# Altium schematic sheet Sheet2.SchDoc
size A4
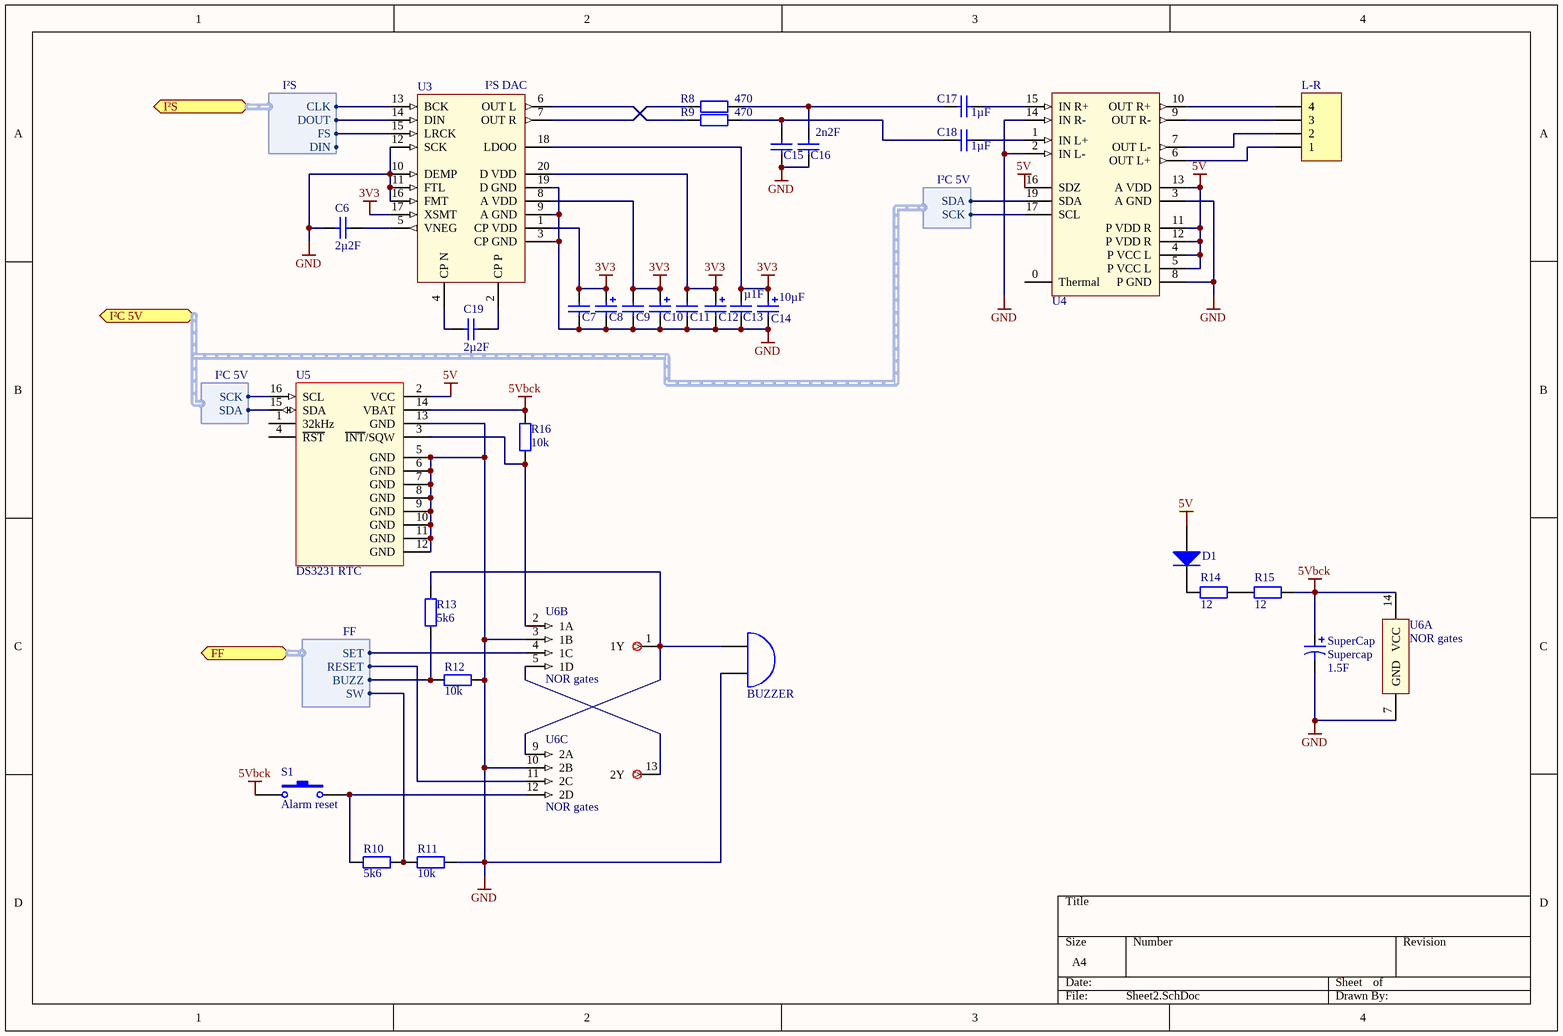
[diagram p0: Sheet2.SchDoc]

## Parts
BUZZER  (no value)  [HDR1X2]
C6  value 2µ2F  [C0805]
C7  value µ1F  [C0805]
C8  (no value)  [SMD cap 6x5]
C9  (no value)  [C0805]
C10  (no value)  [SMD cap 6x5]
C11  (no value)  [C0805]
C12  (no value)  [SMD cap 6x5]
C13  (no value)  [C0805]
C14  value 10µF  [SMD cap 6x5]
C15  (no value)  [C0805]
C16  value 2n2F  [C0805]
C17  value 1µF  [C0805]
C18  value 1µF  [C0805]
C19  value 2µ2F  [C0805]
D1  (no value)  [AXIAL-0.3]
L-R  Header 4  [HDR1X4]  (value not drawn)
R8  value 470  [C1206]
R9  value 470  [C1206]
R10  value 5k6  [C1206]
R11  value 10k  [C1206]
R12  value 10k  [C1206]
R13  value 5k6  [C1206]
R14  value 12  [C1206]
R15  value 12  [C1206]
R16  value 10k  [C1206]
S1  Alarm reset  [HDR1X2]
SuperCap  Supercap  value 1.5F  [HDR1X2]
U3  I²S DAC  [TSSOP-20]
U4  TPA2016D2  [QFN20-tpa2016d2]  (value not drawn)
U5  DS3231 RTC  [DS3231 SO-16]
U6  NOR gates  [SOIC-14]  (parts A,B,C of 3)

## Ports
FF (harness FF), I²C 5V (harness I²C 5V), I²S (harness I²S)

## Harnesses
I²S: CLK, FS, DOUT, DIN
I²C 5V: SCK, SDA
FF: SET, RESET, BUZZ, SW

## Nets
3V3: C7.1 C8.1 C9.1 C10.1 C11.2 C12.1 C13.1 C14.1 U3.1(CP_VDD) U3.8(A_VDD) U3.17(XSMT) U3.18(LDOO) U3.20(D_VDD)
5V: D1.1(A) U4.4(P_VCC_L) U4.5(P_VCC_L) U4.11(P_VDD_R) U4.12(P_VDD_R) U4.13(A_VDD) U4.16(SDZ) U5.2(VCC)
5Vbck: R15.2 R16.2 S1.1 SuperCap.1 U5.14(VBAT) U6.14(VCC)
GND: BUZZER.1(A) C6.1 C7.2 C8.2 C9.2 C10.2 C11.1 C12.2 C13.2 C14.2 C15.2 C16.2 R11.1 R12.1 SuperCap.2 U3.3(CP_GND) U3.9(A_GND) U3.10(DEMP) U3.11(FTL) U3.12(SCK) U3.16(FMT) U3.19(D_GND) U4.2(IN_L-) U4.3(A_GND) U4.8(P_GND) U4.14(IN_R-) U5.5(GND) U5.6(GND) U5.7(GND) U5.8(GND) U5.9(GND) U5.10(GND) U5.11(GND) U5.12(GND) U5.13(GND) U6.3(1B) U6.7(GND) U6.10(2B)
NetBUZZER_2: BUZZER.2(B) R13.1 U6.1(1Y) U6.9(2A)
NetC6_2: C6.2 U3.5(VNEG)
NetC15_1: C15.1 C18.2 R9.2
NetC16_1: C16.1 C17.2 R8.2
NetC17_1: C17.1 U4.15(IN_R+)
NetC18_1: C18.1 U4.1(IN_L+)
NetC19_1: C19.1 U3.2(CP_P)
NetC19_2: C19.2 U3.4(CP_N)
NetD1_2: D1.2(K) R14.1
NetL-R_1: L-R.1 U4.6(OUT_L+)
NetL-R_2: L-R.2 U4.7(OUT_L-)
NetL-R_3: L-R.3 U4.9(OUT_R-)
NetL-R_4: L-R.4 U4.10(OUT_R+)
NetR8_1: R8.1 U3.7(OUT_R)
NetR9_1: R9.1 U3.6(OUT_L)
NetR10_1: R10.1 R11.2 ; port FF.SW
NetR10_2: R10.2 S1.2 U6.12(2D)
NetR12_2: R12.2 R13.2 ; port FF.BUZZ
NetR14_2: R14.2 R15.1
NetR16_1: R16.1 U5.3(~{INT}/SQW) U6.2(1A)
NetU3_13: U3.13(BCK) ; port I²S.CLK
NetU3_14: U3.14(DIN) ; port I²S.DOUT
NetU3_15: U3.15(LRCK) ; port I²S.FS
NetU4_17: U4.17(SCL) U5.16(SCL) ; port I²C 5V.SCK
NetU4_19: U4.19(SDA) U5.15(SDA) ; port I²C 5V.SDA
NetU6_4: U6.4(1C) ; port FF.SET
NetU6_5: U6.5(1D) U6.13(2Y)
NetU6_11: U6.11(2C) ; port FF.RESET

Not connected (* = marked no-connect by the designer): U4 0(Thermal); U5 1(32kHz) 4(~{RST})

## Library data of the parts
BUZZER = Bell: Electrical Bell; Published: 24-Mar-1999; LatestRevisionDate: 17-Jul-2002; LatestRevisionNote: Re-released for DXP Platform.; PackageReference: PIN2; Publisher: Altium Limited
C6 C7 C16-C19 = Cap: Capacitor; Published: 8-Jun-2000; LatestRevisionDate: 17-Jul-2002; LatestRevisionNote: Re-released for DXP Platform.; PackageReference: RAD-0.3; Publisher: Altium Limited; PackageDescription: Radial Cap, Thru-Hole; 2 Leads; 0.3 in Pin Spacing
C8 C10 C12 = Cap Pol2: Polarized Capacitor (Axial); Value: 10µF; Published: 8-Jun-2000; LatestRevisionDate: 17-Jul-2002; LatestRevisionNote: Re-released for DXP Platform.; PackageReference: POLAR0.8; Publisher: Altium Limited; PackageDescription: Polarized Capacitor; 2 Leads
C9 C11 C13 = Cap: Capacitor; Value: 0.1µF; Published: 8-Jun-2000; LatestRevisionDate: 17-Jul-2002; LatestRevisionNote: Re-released for DXP Platform.; PackageReference: RAD-0.3; Publisher: Altium Limited; PackageDescription: Radial Cap, Thru-Hole; 2 Leads; 0.3 in Pin Spacing
C14 = Cap Pol2: Polarized Capacitor (Axial); Published: 8-Jun-2000; LatestRevisionDate: 17-Jul-2002; LatestRevisionNote: Re-released for DXP Platform.; PackageReference: POLAR0.8; Publisher: Altium Limited; PackageDescription: Polarized Capacitor; 2 Leads
C15 = Cap: Capacitor; Value: 2n2F; Published: 8-Jun-2000; LatestRevisionDate: 17-Jul-2002; LatestRevisionNote: Re-released for DXP Platform.; PackageReference: RAD-0.3; Publisher: Altium Limited; PackageDescription: Radial Cap, Thru-Hole; 2 Leads; 0.3 in Pin Spacing
D1 = Diode: Default Diode; Published: 8-Jun-2000; LatestRevisionDate: 17-Jul-2002; LatestRevisionNote: Re-released for DXP Platform.; PackageVersion: Sep-1996; PackageReference: SMC; Publisher: Altium Limited; PackageDescription: DO-214-AB/SMC; 2 C-Bend Leads; Body 7.9 x 5.9 mm, inc. leads (LxW); Code_JEDEC: DO-214-AB
L-R = Header 4: Header, 4-Pin; LatestRevisionDate: 17-Jul-2002; LatestRevisionNote: Re-released for DXP Platform.; Publisher: Altium Limited
R8-R16 = Res2: Resistor; Published: 8-Jun-2000; LatestRevisionDate: 17-Jul-2002; LatestRevisionNote: Re-released for DXP Platform.; PackageReference: AXIAL-0.4; Publisher: Altium Limited; PackageDescription: Axial Device, Thru-Hole; 2 Leads; 0.4 in Pin Spacing
S1 = SW-PB: Switch; Published: 24-Mar-1999; LatestRevisionDate: 17-Jul-2002; LatestRevisionNote: Re-released for DXP Platform.; PackageReference: SPST-2; Publisher: Altium Limited; PackageDescription: Switch; 2 Leads
SuperCap = Cap Pol1: Polarized Capacitor (Radial); pin to pad: 1>2 2>1; Published: 8-Jun-2000; LatestRevisionDate: 17-Jul-2002; LatestRevisionNote: Re-released for DXP Platform.; PackageReference: RB7.6-15; Publisher: Altium Limited; PackageDescription: Polarized Capacitor (Radial); 2 Leads
U3 = PCM5102A
U4 = TPA2016D2: I²C Audio Amplifier
U5 = DS3231: RTC
U6 = 744002: Dual 4-input NOR gate